# Altium schematic sheet TouchPad.SchDoc
size A3
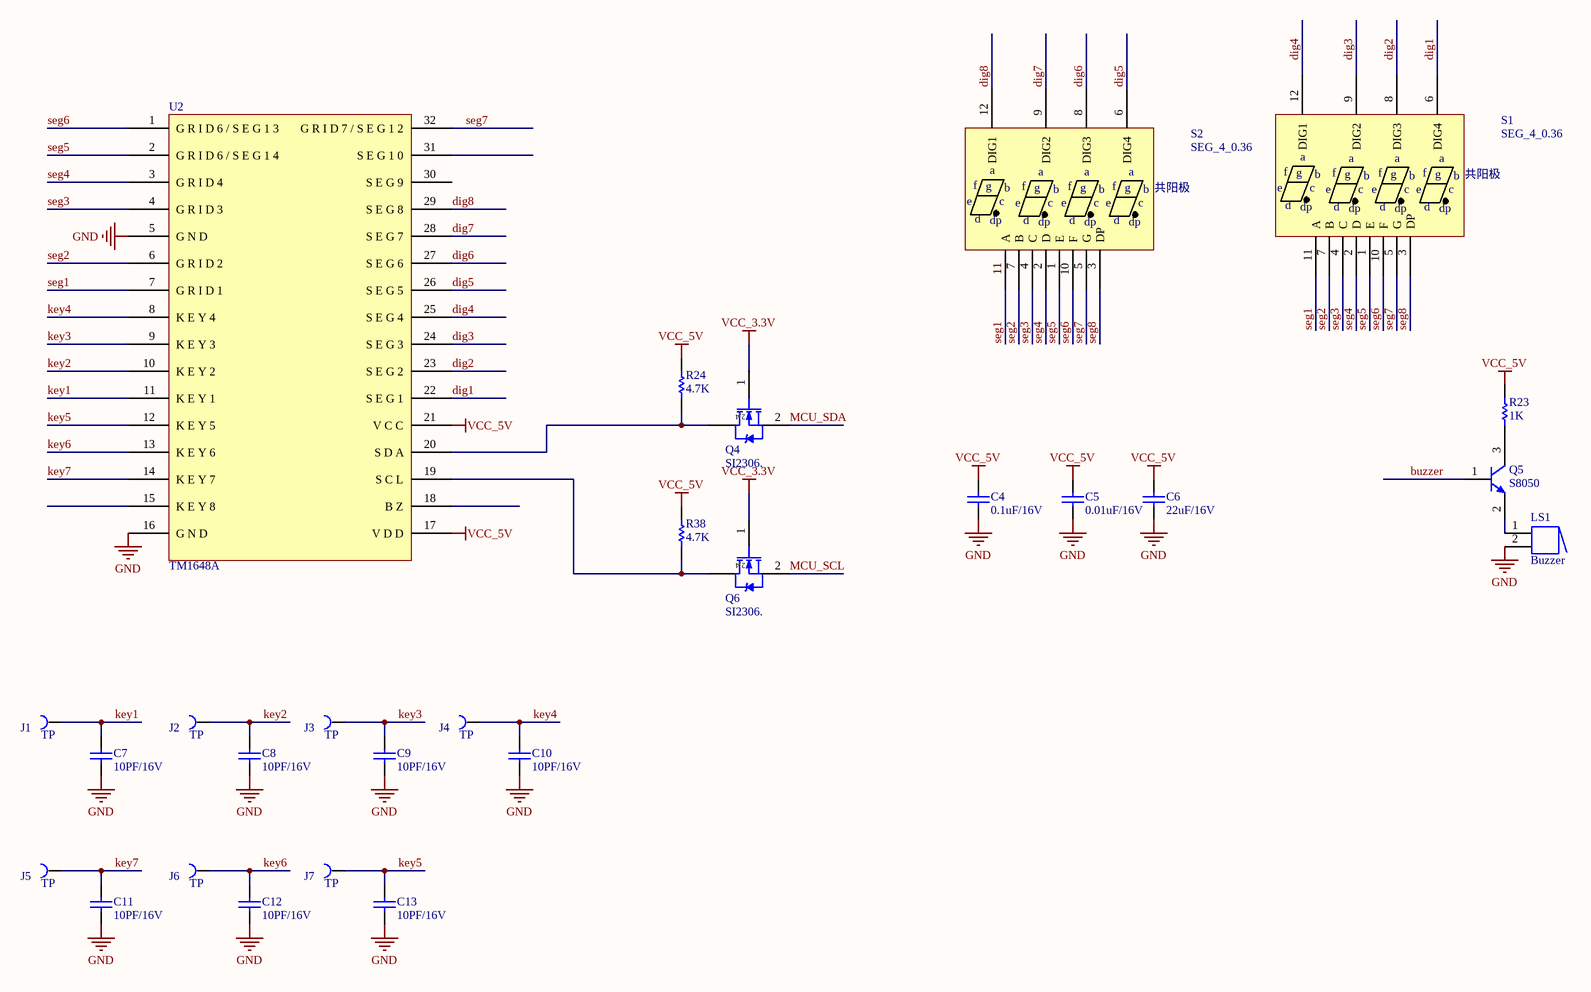
[diagram p0: TouchPad.SchDoc]

## Parts
C4  0.1uF/16V  [0603C]
C5  0.01uF/16V  [0603C]
C6  22uF/16V  [0805C]
C7  10PF/16V  [0603C]
C8  10PF/16V  [0603C]
C9  10PF/16V  [0603C]
C10  10PF/16V  [0603C]
C11  10PF/16V  [0603C]
C12  10PF/16V  [0603C]
C13  10PF/16V  [0603C]
J1  TP  [TOUCHU_PAD]
J2  TP  [TOUCHU_PAD]
J3  TP  [TOUCHU_PAD]
J4  TP  [TOUCHU_PAD]
J5  TP  [TOUCHU_PAD]
J6  TP  [TOUCHU_PAD]
J7  TP  [TOUCHU_PAD]
LS1  Buzzer  [BUFFER_0905]
Q4  SI2306.  [SOT23-3]
Q5  S8050  [sot23-3]
Q6  SI2306.  [SOT23-3]
R23  1K  [0603R]
R24  4.7K  [0603R]
R38  4.7K  [0603R]
S1  SEG_4_0.36  [DISPLAY_0.36INCH_4]
S2  SEG_4_0.36  [DISPLAY_0.36INCH_4]
U2  TM1648A  [SOP127P1040X265-32N]

## Nets
GND: C4.2 C5.2 C6.2 C7.1 C8.1 C9.1 C10.1 C11.1 C12.1 C13.1 LS1.2 U2.5(G_N_D) U2.16(G_N_D)
VCC_3.3V: Q4.1(G) Q6.1(G)
VCC_5V: C4.1 C5.1 C6.1 R23.1 R24.2 R38.2 U2.17(V_D_D) U2.21(V_C_C)
buzzer: Q5.1(B)
dig1: S1.6(DIG4) U2.22(S_E_G_1)
dig2: S1.8(DIG3) U2.23(S_E_G_2)
dig3: S1.9(DIG2) U2.24(S_E_G_3)
dig4: S1.12(DIG1) U2.25(S_E_G_4)
dig5: S2.6(DIG4) U2.26(S_E_G_5)
dig6: S2.8(DIG3) U2.27(S_E_G_6)
dig7: S2.9(DIG2) U2.28(S_E_G_7)
dig8: S2.12(DIG1) U2.29(S_E_G_8)
key1: C7.2 J1.1 U2.11(K_E_Y_1)
key2: C8.2 J2.1 U2.10(K_E_Y_2)
key3: C9.2 J3.1 U2.9(K_E_Y_3)
key4: C10.2 J4.1 U2.8(K_E_Y_4)
key5: C13.2 J7.1 U2.12(K_E_Y_5)
key6: C12.2 J6.1 U2.13(K_E_Y_6)
key7: C11.2 J5.1 U2.14(K_E_Y_7)
MCU_SCL: Q6.2(S)
MCU_SDA: Q4.2(S)
seg1: S1.11(A) S2.11(A) U2.7(G_R_I_D_1)
seg2: S1.7(B) S2.7(B) U2.6(G_R_I_D_2)
seg3: S1.4(C) S2.4(C) U2.4(G_R_I_D_3)
seg4: S1.2(D) S2.2(D) U2.3(G_R_I_D_4)
seg5: S1.1(E) S2.1(E) U2.2(G_R_I_D_6_/_S_E_G_1_4)
seg6: S1.10(F) S2.10(F) U2.1(G_R_I_D_6_/_S_E_G_1_3)
seg7: S1.5(G) S2.5(G) U2.32(G_R_I_D_7_/_S_E_G_1_2)
seg8: S1.3(DP) S2.3(DP)
NetLS1_1: LS1.1 Q5.2(E)
NetQ4_3: Q4.3(D) R24.1 U2.20(S_D_A)
NetQ5_3: Q5.3(C) R23.2
NetQ6_3: Q6.3(D) R38.1 U2.19(S_C_L)

Not connected (* = marked no-connect by the designer): U2 15(K_E_Y_8) 18(B_Z) 30(S_E_G_9) 31(S_E_G_1_0)

## Notes on the sheet
- (in symbol BUK92150-55A) 2,4
- (in symbol SEG_4_0.36) a; f; g; b; 共阳极; e; c; d; dp

## Library data of the parts
C4-C13 = Cap: Capacitor; Value: 2.2uF/6.3V; Published: 8-Jun-2000; LatestRevisionDate: 17-Jul-2002; LatestRevisionNote: Re-released for DXP Platform.; PackageReference: RAD-0.3; Publisher: Altium Limited
J1-J7 = TOUCH_PAD: TEST_3P
LS1 = Buzzer: Magnetic Transducer Buzzer; Published: 24-Mar-1999; LatestRevisionDate: 17-Dec-2003; LatestRevisionNote: Schematic revised, PCB Footprint replaced.; DatasheetVersion: 17-Dec-2003; PackageReference: ABSM-1574; Publisher: Altium Limited; ComponentLink1Description: Manufacturer Link; ComponentLink1URL: http://www.megastar.com/linecard/buzzmode/index.php
Q4 Q6 = BUK92150-55A: Published: 8-Jun-2000; LatestRevisionDate: 17-Jul-2002; LatestRevisionNote: Re-released for DXP Platform.; DatasheetVersion: 6-Oct-1997; PackageVersion: Aug-1998; PackageReference: TSOP-6; Publisher: Altium Limited; PackageDescription: SOT-457/SC-74; 6 Leads; Body 3.1 x 3 mm, inc. leads (LxW max); ComponentLink1Description: Manufacturer Link; ComponentLink1URL: http://www.vishay.com/; ComponentLink2Description: Datasheet; ComponentLink2URL: http://www.vishay.com/docs/70192/70192.pdf
Q5 = NPN: NPN Bipolar Transistor; Published: 8-Jun-2000; LatestRevisionDate: 17-Jul-2002; LatestRevisionNote: Re-released for DXP Platform.; PackageReference: TO-226; Publisher: Altium Limited; Code_JEDEC: TO-226-AA
R23 = Res1: Resistor; Published: 8-Jun-2000; LatestRevisionDate: 17-Jul-2002; LatestRevisionNote: Re-released for DXP Platform.; PackageReference: AXIAL-0.3; Publisher: Altium Limited; Value: 1K
R24 R38 = Res1: Resistor; Value: 1K; Published: 8-Jun-2000; LatestRevisionDate: 17-Jul-2002; LatestRevisionNote: Re-released for DXP Platform.; PackageReference: AXIAL-0.3; Publisher: Altium Limited